# Altium schematic sheet LMT01 Interface.schdoc
size A4
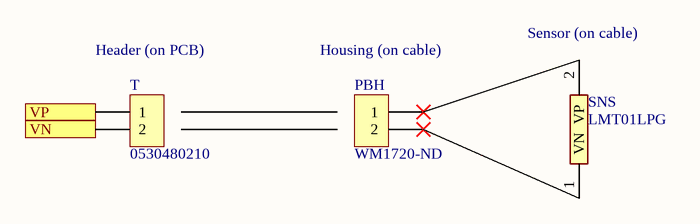
[diagram p0: LMT01 Interface.schdoc]

## Parts
PBH  MF Part No.: WM1720-ND  (hidden comment: 0530480210)  (mechanical)
SNS  LMT01LPG  [LPG0002A]  (mechanical)
T  0530480210  [MOLEX_0530480210]

## Ports
VN, VP (in)

## Nets
VN: T.2 ; port VN
VP: T.1 ; port VP

Not connected (* = marked no-connect by the designer): PBH 1* 2*; SNS 1(VN) 2(VP)

## Notes on the sheet
- (near T) Header (on PCB)
- (near PBH) Housing (on cable)
- (near SNS) Sensor (on cable)

## Library data of the parts
PBH = 0530480210: Housing - Picoblade 02-pin, TH, RA; APSS Standard Part: APSS Standard; Pitch: 1.25mm; Pins: 2; Supplier 1: Digikey; Supplier 1 Part No.: 0510210200
SNS = LMT01LPG: 0.5Â°C Accurate 2-pin Temperature Sensor with a Pulse Train Interface; Rated Voltage: 2V ~ 5.5V; MF Part No.: LMT01LPG; Package: TO-92-2; Supplier 1: Digikey; Supplier 1 Part No.: 296-42299-ND
T = 0530480210: Header - Picoblade 02-pin, TH, RA; APSS Standard Part: APSS Standard; Pitch: 1.25mm; Mounting Type: Through-hole; Orientation: Right Angle; Pins: 2; Supplier 1: Digikey; Supplier 1 Part No.: 530480210; MF Part No.: 0530480210